# Altium project BAI 7.PrjPcb
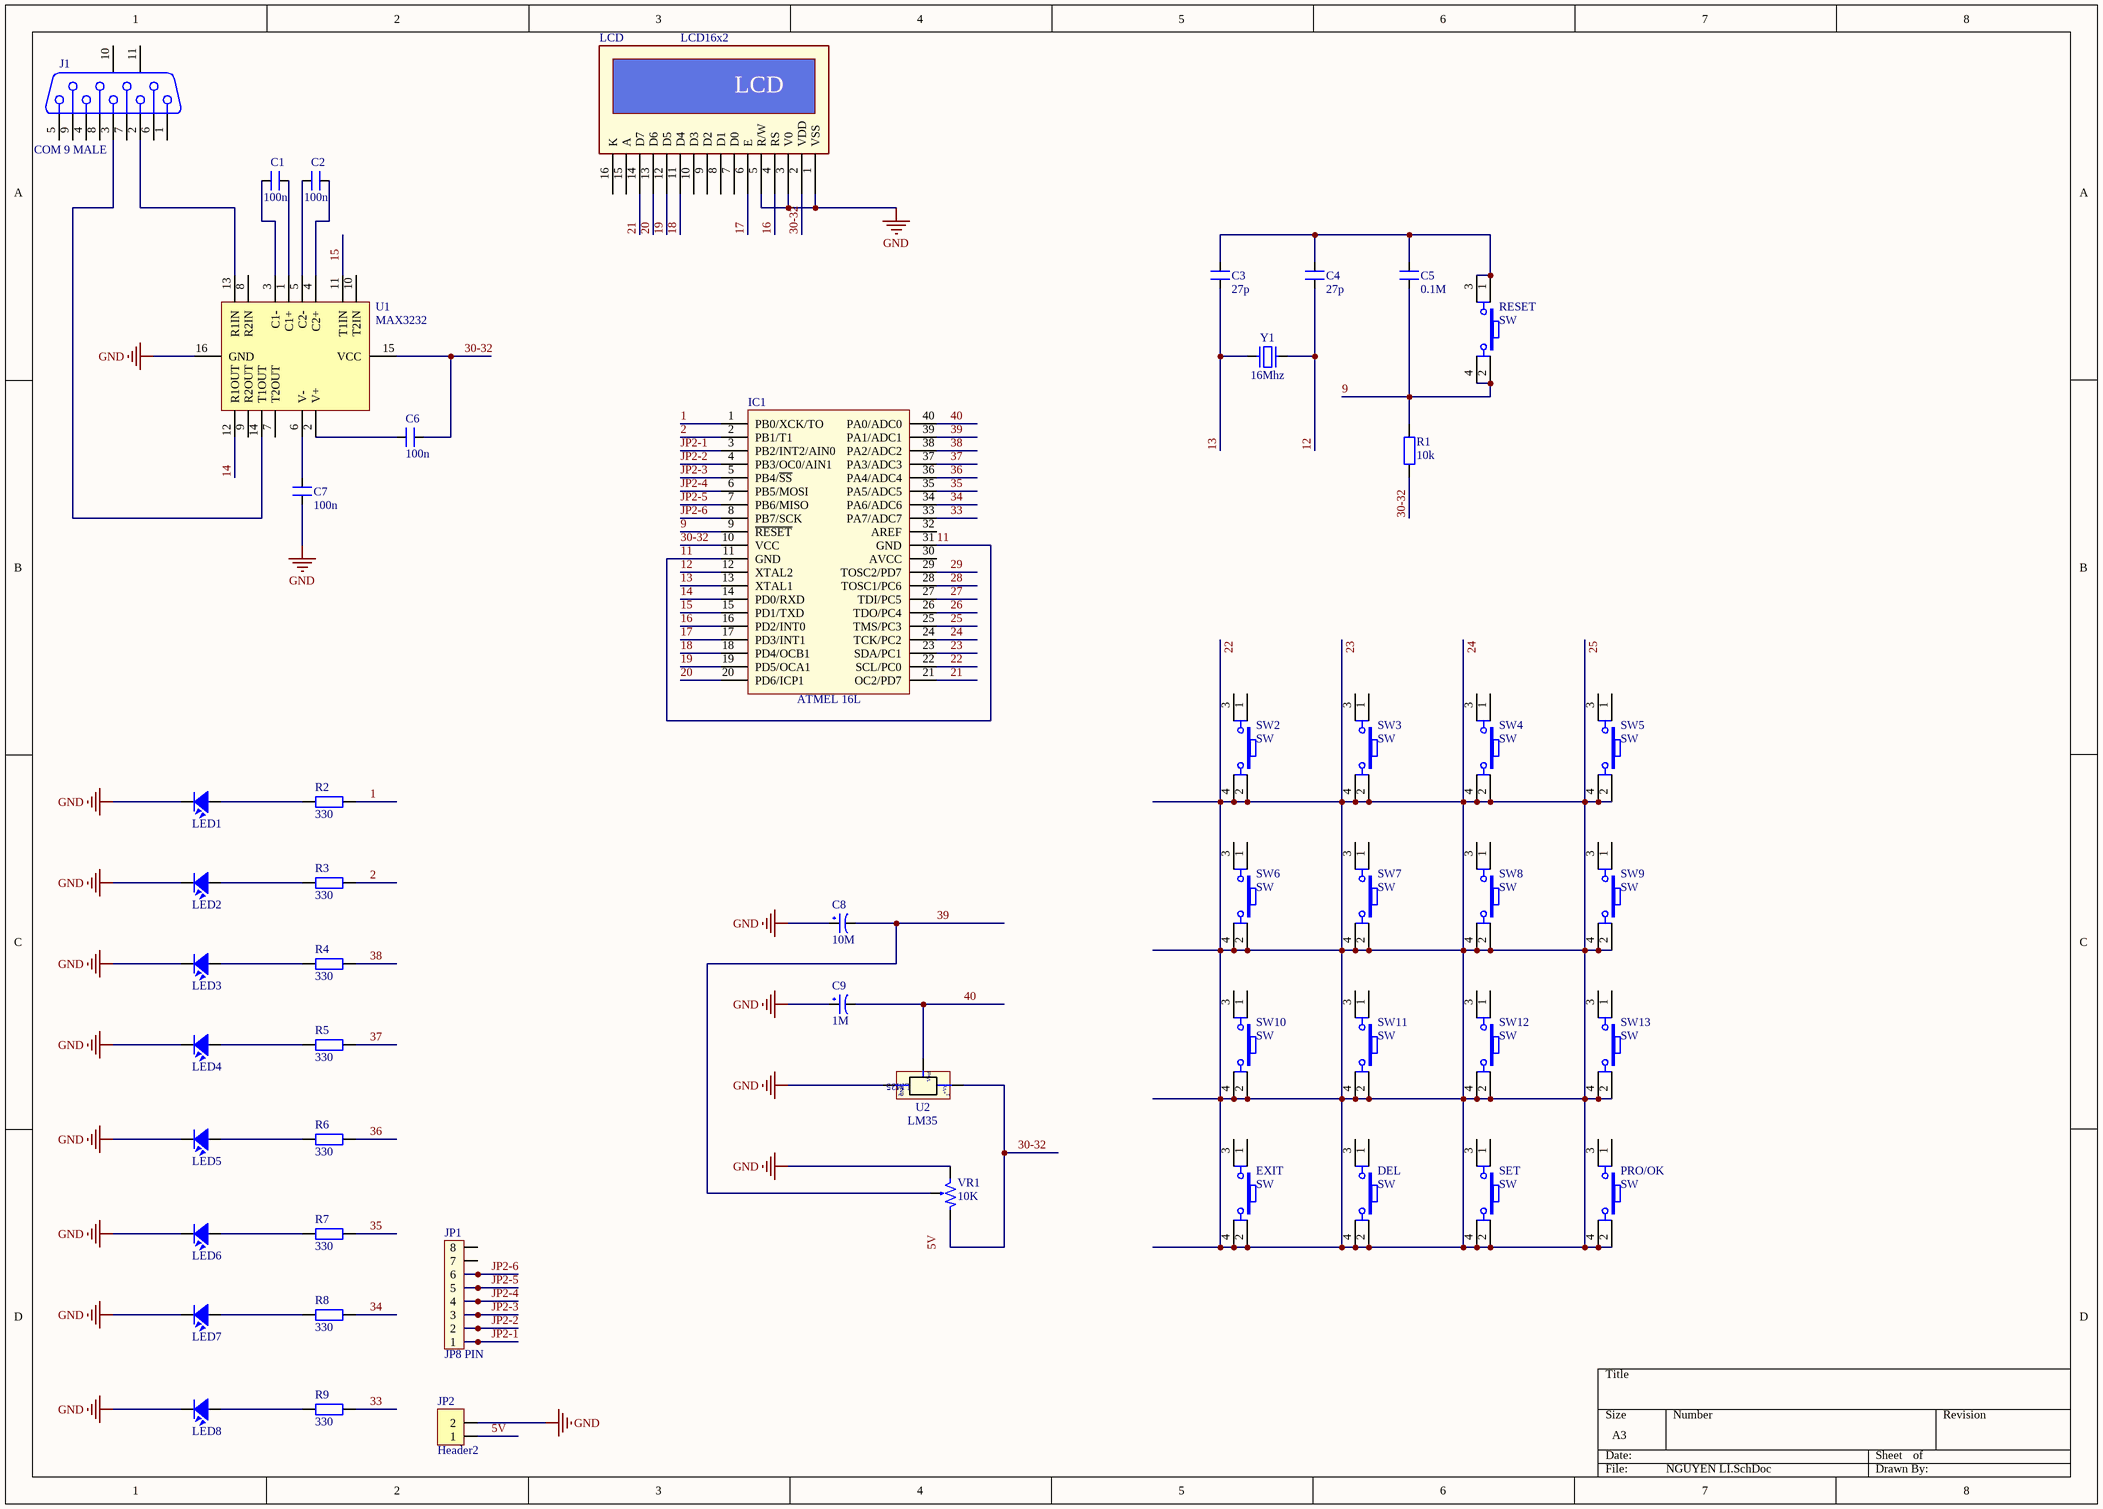
[diagram p0: NGUYEN LI.SchDoc]
1 sheet, 52 parts. Net scope: global (net labels, ports and power ports of the same name join across sheets).
Board file: PCB.PcbDoc

## Sheet NGUYEN LI.SchDoc
size A3; SheetNumber: 1; SheetTotal: 1

### Parts
C1  100n  [CN1]
C2  100n  [CN1]
C3  27p  [CN1]
C4  27p  [CN1]
C5  0.1M  [CN1]
C6  100n  [CN1]
C7  100n  [CN1]
C8  10M  [CP1.5/3.4]
C9  1M  [CP1.5/3.4]
DEL  SW  [SW4B]
EXIT  SW  [SW4B]
IC1  ATMEL 16L  [DIP40/W0.6]
J1  COM 9 MALE  [DSB 9-M]
JP1  JP8 PIN  [JP8]
JP2  Header2  [Header2]
LCD  LCD16x2  [LCD16X2]
LED1  LED  [LED-3]  (value not drawn)
LED2  LED  [LED-3]  (value not drawn)
LED3  LED  [LED-3]  (value not drawn)
LED4  LED  [LED-3]  (value not drawn)
LED5  LED  [LED-3]  (value not drawn)
LED6  LED  [LED-3]  (value not drawn)
LED7  LED  [LED-3]  (value not drawn)
LED8  LED  [LED-3]  (value not drawn)
PRO/OK  SW  [SW4B]
R1  10k  [R1/4W]
R2  330  [R1/4W]
R3  330  [R1/4W]
R4  330  [R1/4W]
R5  330  [R1/4W]
R6  330  [R1/4W]
R7  330  [R1/4W]
R8  330  [R1/4W]
R9  330  [R1/4W]
RESET  SW  [SW4B]
SET  SW  [SW4B]
SW2  SW  [SW4B]
SW3  SW  [SW4B]
SW4  SW  [SW4B]
SW5  SW  [SW4B]
SW6  SW  [SW4B]
SW7  SW  [SW4B]
SW8  SW  [SW4B]
SW9  SW  [SW4B]
SW10  SW  [SW4B]
SW11  SW  [SW4B]
SW12  SW  [SW4B]
SW13  SW  [SW4B]
U1  MAX3232  [DIP16]
U2  LM35  [QTO-92]
VR1  10K  [VR1]
Y1  16Mhz  [XT2]

### Nets
GND: C7.1 C8.1 C9.1 JP2.2 LCD.1(VSS) LCD.3(V0) LCD.5(R/W) LED1.2 LED2.2 LED3.2 LED4.2 LED5.2 LED6.2 LED7.2 LED8.2 U1.16(GND) U2.3(-) VR1.3
1: IC1.1(PB0/XCK/TO) R2.2
2: IC1.2(PB1/T1) R3.2
5V: JP2.1
9: C5.2 IC1.9(~{RESET}) R1.1 RESET.2 RESET.4
11: IC1.11(GND) IC1.31(GND)
12: C4.2 IC1.12(XTAL2) Y1.2
13: C3.2 IC1.13(XTAL1) Y1.1
14: IC1.14(PD0/RXD) U1.12(R1OUT)
15: IC1.15(PD1/TXD) U1.11(T1IN)
16: IC1.16(PD2/INT0) LCD.4(RS)
17: IC1.17(PD3/INT1) LCD.6(E)
18: IC1.18(PD4/OCB1) LCD.11(D4)
19: IC1.19(PD5/OCA1) LCD.12(D5)
20: IC1.20(PD6/ICP1) LCD.13(D6)
21: IC1.21(OC2/PD7) LCD.14(D7)
22: DEL.2 DEL.4 EXIT.2 EXIT.4 IC1.22(SCL/PC0) IC1.23(SDA/PC1) IC1.24(TCK/PC2) IC1.25(TMS/PC3) PRO/OK.2 PRO/OK.4 SET.2 SET.4 SW2.2 SW2.4 SW3.2 SW3.4 SW4.2 SW4.4 SW5.2 SW5.4 SW6.2 SW6.4 SW7.2 SW7.4 SW8.2 SW8.4 SW9.2 SW9.4 SW10.2 SW10.4 SW11.2 SW11.4 SW12.2 SW12.4 SW13.2 SW13.4  [also labelled 23, 24, 25]
26: IC1.26(TDO/PC4)
27: IC1.27(TDI/PC5)
28: IC1.28(TOSC1/PC6)
29: IC1.29(TOSC2/PD7)
30-32: C6.2 IC1.10(VCC) LCD.2(VDD) R1.2 U1.15(VCC) U2.1(+Vs) VR1.1
33: IC1.33(PA7/ADC7) R9.2
34: IC1.34(PA6/ADC6) R8.2
35: IC1.35(PA5/ADC5) R7.2
36: IC1.36(PA4/ADC4) R6.2
37: IC1.37(PA3/ADC3) R5.2
38: IC1.38(PA2/ADC2) R4.2
39: C8.2 IC1.39(PA1/ADC1) VR1.2
40: C9.2 IC1.40(PA0/ADC0) U2.2(Vout)
JP2-1: IC1.3(PB2/INT2/AIN0) JP1.1
JP2-2: IC1.4(PB3/OC0/AIN1) JP1.2
JP2-3: IC1.5(PB4/~{SS}) JP1.3
JP2-4: IC1.6(PB5/MOSI) JP1.4
JP2-5: IC1.7(PB6/MISO) JP1.5
JP2-6: IC1.8(PB7/SCK) JP1.6
NetC1_1: C1.1 U1.3(C1-)
NetC1_2: C1.2 U1.1(C1+)
NetC2_1: C2.1 U1.5(C2-)
NetC2_2: C2.2 U1.4(C2+)
NetC3_1: C3.1 C4.1 C5.1 RESET.1 RESET.3
NetC6_1: C6.1 U1.2(V+)
NetC7_2: C7.2 U1.6(V-)
NetJ1_2: J1.2 U1.13(R1IN)
NetJ1_3: J1.3 U1.14(T1OUT)
NetLED1_1: LED1.1 R2.1
NetLED2_1: LED2.1 R3.1
NetLED3_1: LED3.1 R4.1
NetLED4_1: LED4.1 R5.1
NetLED5_1: LED5.1 R6.1
NetLED6_1: LED6.1 R7.1
NetLED7_1: LED7.1 R8.1
NetLED8_1: LED8.1 R9.1

Not connected (* = marked no-connect by the designer): DEL 1 3; EXIT 1 3; IC1 30(AVCC) 32(AREF); J1 1 4 5 6 7 8 9 10(MH1) 11(MH2); JP1 7 8; LCD 7(D0) 8(D1) 9(D2) 10(D3) 15(A) 16(K); PRO/OK 1 3; SET 1 3; SW2 1 3; SW3 1 3; SW4 1 3; SW5 1 3; SW6 1 3; SW7 1 3; SW8 1 3; SW9 1 3; SW10 1 3; SW11 1 3; SW12 1 3; SW13 1 3; U1 7(T2OUT) 8(R2IN) 9(R2OUT) 10(T2IN)

### Notes on the sheet
- Labels drawn without touching a wire or pin: 5V
- (in symbol LM35) GND

### Library data of the parts
C1-C7 = CN1: Cap np  1pF - 472pF; Value: 100pF
C8 C9 = CP4: Cap 1000uF/16V - 220uF/50V; Description 5: 4,7uF>10uF/250V_3,3uF>10uF/400V - 2,2uF>4,7uF/450V; Description 1: 2200uF-3300uF/6,3V - 1000uF-2200uF/10V; Description 2: 1000uF/16V - 470uF => 1000uF/25V - 100uF/100V; Description 3: 330uF>470uF/35V_220uF>470uF/50V_10uF>22uF/250V; Description 4: 220uF => 330uF/63V - 10uF =>33uF/160 - 200V; Value: 1000uF/16V
DEL EXIT PRO/OK RESET SET SW2-SW13 = SW4: Switch button 4 pin; Value: Button chip 4 pin
IC1 = Atmega16L: 8-Bit AVR Microcontroller with 16K Bytes of In-System Programmable Flash Memory; Value: Atmega 16L
J1 = DSB9M: COM 9; PackageDocument: O; Positions: 9; Gender: Receptacle; Value: COM 9; Published: 15-Jun-2001; LatestRevisionDate: 17-Jul-2002; LatestRevisionNote: Re-released for DXP Platform.; DatasheetDocument: 1-Sep-1999; PackageReference: 788750; Publisher: Altium Limited; Orientation: Right Angle
JP1 = JP8: Value: JP7
JP2 = Header2: Header IDC, 2 x 1 Pin Vertical 2.54mm Pitch (Non-Boxed, Male); Manufacturer: W¨¹rth Elektronik eiSos GmbH; partNo: 613002143121; ComponentLink1 Description: Manufacturer; ComponentLink2 Description: Datasheet; NoPins: 02; Created Date: 29 March 2013; ComponentLink1URL: http://www.we-online.com; ComponentLink2URL: http://katalog.we-online.de/em/datasheet/6130xx143121.pdf; Created by: Karrer Zheng
LCD = LCD Text
LED1-LED8 = LED: LED Single colour Green and Red; Value: LED 3 ly Single Colour
R1-R9 = R1/4W: Resistor 1/4W; Value: R1/4W - 1K
U1 = MAX3232: Manufacturer Part Number: MAX232DR; Manufacturer: Texas Instruments; Protocol: RS232; Number of Drivers/Receivers: 2/2; Voltage - Supply: 4.5 V ~ 5.5 V; Supplier 1: Digi-Key; Supplier Part Number 1: 296-14619-1-ND; RoHS: RoHS Compliant; Packaging: Cut Tape (CT); Type: Transceiver; Supplier Part Number: 296-14619-1-ND; Supplier: Digi-Key; Category: Integrated Circuits (ICs); Package / Case: 16-SOIC (3.9mm Width)
U2 = LM35: Teminal; Value: LM35
VR1 = VR1: Var Resistor; Value: VR 10K
Y1 = XT2: Crystal For all Crystal 2pin.; Value: 4Mhz